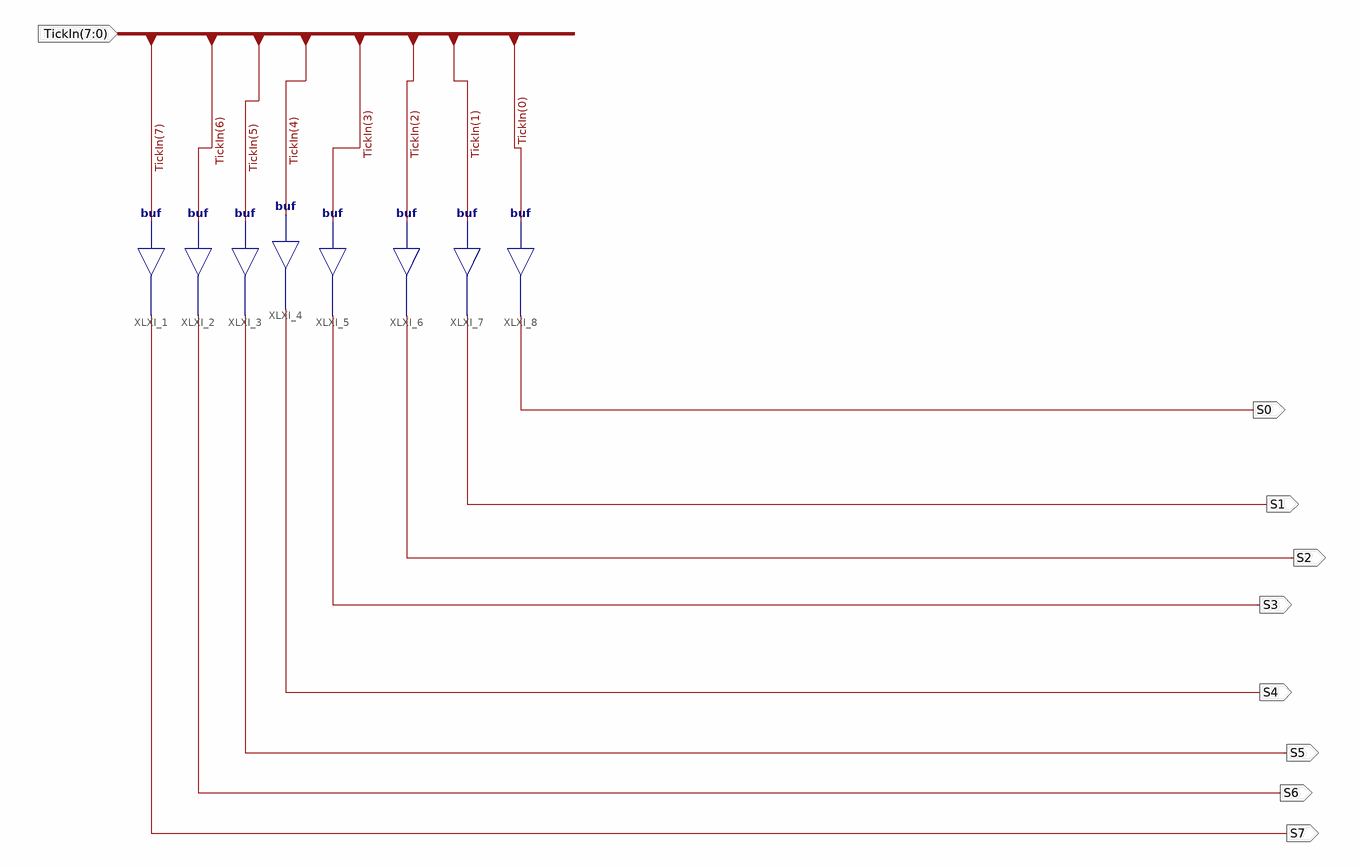
[diagram p0: schematic sheet 1]
// Xilinx ISE schematic TickSplit.sch (spartan3e) as structural Verilog: 8 symbols, 9 ports
module TickSplit (
  input  [7:0] TickIn,
  output S0,
  output S1,
  output S2,
  output S3,
  output S4,
  output S5,
  output S6,
  output S7
);

  buf XLXI_1 (S7, TickIn[7]);
  buf XLXI_2 (S6, TickIn[6]);
  buf XLXI_3 (S5, TickIn[5]);
  buf XLXI_4 (S4, TickIn[4]);
  buf XLXI_5 (S3, TickIn[3]);
  buf XLXI_6 (S2, TickIn[2]);
  buf XLXI_7 (S1, TickIn[1]);
  buf XLXI_8 (S0, TickIn[0]);
endmodule
